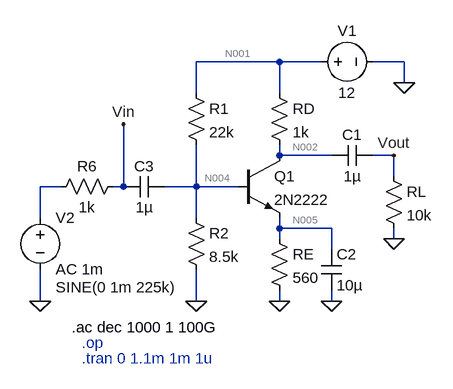
[diagram p0: schematic bjt_ce.asc]
bjt_ce.asc, the LTspice schematic file:
Version 4.1
SHEET 1 880 680
WIRE 224 -16 96 -16
WIRE 288 -16 224 -16
WIRE 416 -16 368 -16
WIRE 416 16 416 -16
WIRE 96 32 96 -16
WIRE 224 32 224 -16
WIRE 224 128 224 112
WIRE 304 128 224 128
WIRE 400 128 368 128
WIRE 400 160 400 128
WIRE -112 176 -144 176
WIRE -16 176 -16 80
WIRE -16 176 -32 176
WIRE 96 176 96 112
WIRE 96 176 48 176
WIRE 160 176 96 176
WIRE -144 224 -144 176
WIRE 96 224 96 176
WIRE 224 240 224 224
WIRE 304 240 224 240
WIRE 224 256 224 240
WIRE 400 256 400 240
WIRE 304 272 304 240
WIRE -144 352 -144 304
WIRE 96 352 96 304
WIRE 224 352 224 336
WIRE 304 352 304 336
FLAG 400 256 0
FLAG 416 16 0
FLAG 96 352 0
FLAG 400 128 Vout
FLAG -16 80 Vin
FLAG 224 352 0
FLAG 304 352 0
FLAG -144 352 0
SYMBOL npn 160 128 R0
SYMATTR InstName Q1
SYMATTR Value 2N2222
SYMBOL res 208 16 R0
SYMATTR InstName RD
SYMATTR Value 1k
SYMBOL cap 368 112 R90
WINDOW 0 0 32 VBottom 2
WINDOW 3 32 32 VTop 2
SYMATTR InstName C1
SYMATTR Value 1µ
SYMBOL res 384 144 R0
SYMATTR InstName RL
SYMATTR Value 10k
SYMBOL res 208 240 R0
SYMATTR InstName RE
SYMATTR Value 560
SYMBOL cap 288 272 R0
SYMATTR InstName C2
SYMATTR Value 10µ
SYMBOL res 80 16 R0
SYMATTR InstName R1
SYMATTR Value 22k
SYMBOL voltage 272 -16 R270
WINDOW 0 32 56 VTop 2
WINDOW 3 -32 56 VBottom 2
WINDOW 123 0 0 Left 0
WINDOW 39 0 0 Left 0
SYMATTR InstName V1
SYMATTR Value 12
SYMBOL res 80 208 R0
SYMATTR InstName R2
SYMATTR Value 8.5k
SYMBOL cap 48 160 R90
WINDOW 0 0 32 VBottom 2
WINDOW 3 32 32 VTop 2
SYMATTR InstName C3
SYMATTR Value 1µ
SYMBOL voltage -144 208 R0
WINDOW 3 24 123 Left 2
WINDOW 123 24 95 Left 2
WINDOW 39 0 0 Left 0
SYMATTR Value SINE(0 1m 225k)
SYMATTR Value2 AC 1m
SYMATTR InstName V2
SYMBOL res -16 160 R90
WINDOW 0 0 56 VBottom 2
WINDOW 3 32 56 VTop 2
SYMATTR InstName R6
SYMATTR Value 1k
TEXT -96 392 Left 2 !.ac dec 1000 1 100G
TEXT -80 416 Left 2 ;.op
TEXT -80 440 Left 2 ;.tran 0 1.1m 1m 1u

The netlist it stands for:
* bjt_ce.asc
Q1 N002 N004 N005 0 2N2222
RD N001 N002 1k
C1 Vout N002 1µ
RL Vout 0 10k
RE N005 0 560
C2 N005 0 10µ
R1 N001 N004 22k
V1 N001 0 12
R2 N004 0 8.5k
C3 N004 Vin 1µ
V2 N003 0 SINE(0 1m 225k) AC 1m
R6 Vin N003 1k
.model NPN NPN
.model PNP PNP
.lib standard.bjt
.ac dec 1000 1 100G
* .op
* .tran 0 1.1m 1m 1u
.backanno
.end

* Results of the author's LTspice run, read from the files saved beside the schematic
* Operating Point, zero values left out:
*   V(n004) = 3.211 V
*   V(n001) = 12 V
*   V(n002) = 7.528 V
*   V(n005) = 2.517 V
*   Ic(Q1) = 4.472 mA
*   Ib(Q1) = 21.74 µA
*   Ie(Q1) = -4.494 mA
*   I(RE) = 4.494 mA
*   I(V1) = -4.872 mA
*   I(RD) = 4.472 mA
*   I(R2) = 377.8 µA
*   I(R1) = 399.5 µA
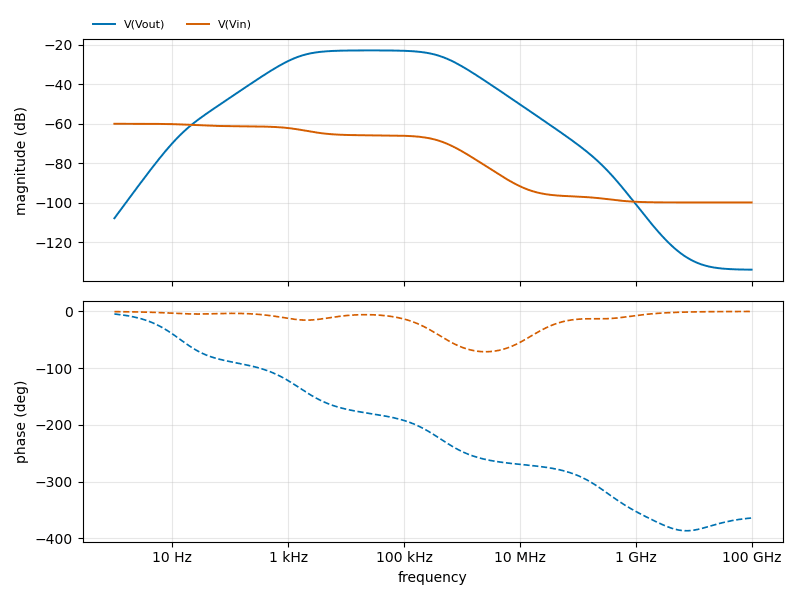
[diagram p1: AC Analysis of bjt_ce.asc, plotted from the saved traces]
* AC Analysis, 1 run:
*   V(Vout): -107.93 dB at 1 Hz, -134.02 dB at 100 GHz, peak -22.77 dB at 26 kHz, 3 dB below the peak at 1.566 kHz and 430.9 kHz
*   V(Vin): -60.00 dB at 1 Hz, -99.93 dB at 100 GHz, peak -60.00 dB at 1 Hz, 3 dB below the peak at 1.6 kHz